# EAGLE design ram (EAGLE 5.12)

## Sheet 1 of 3
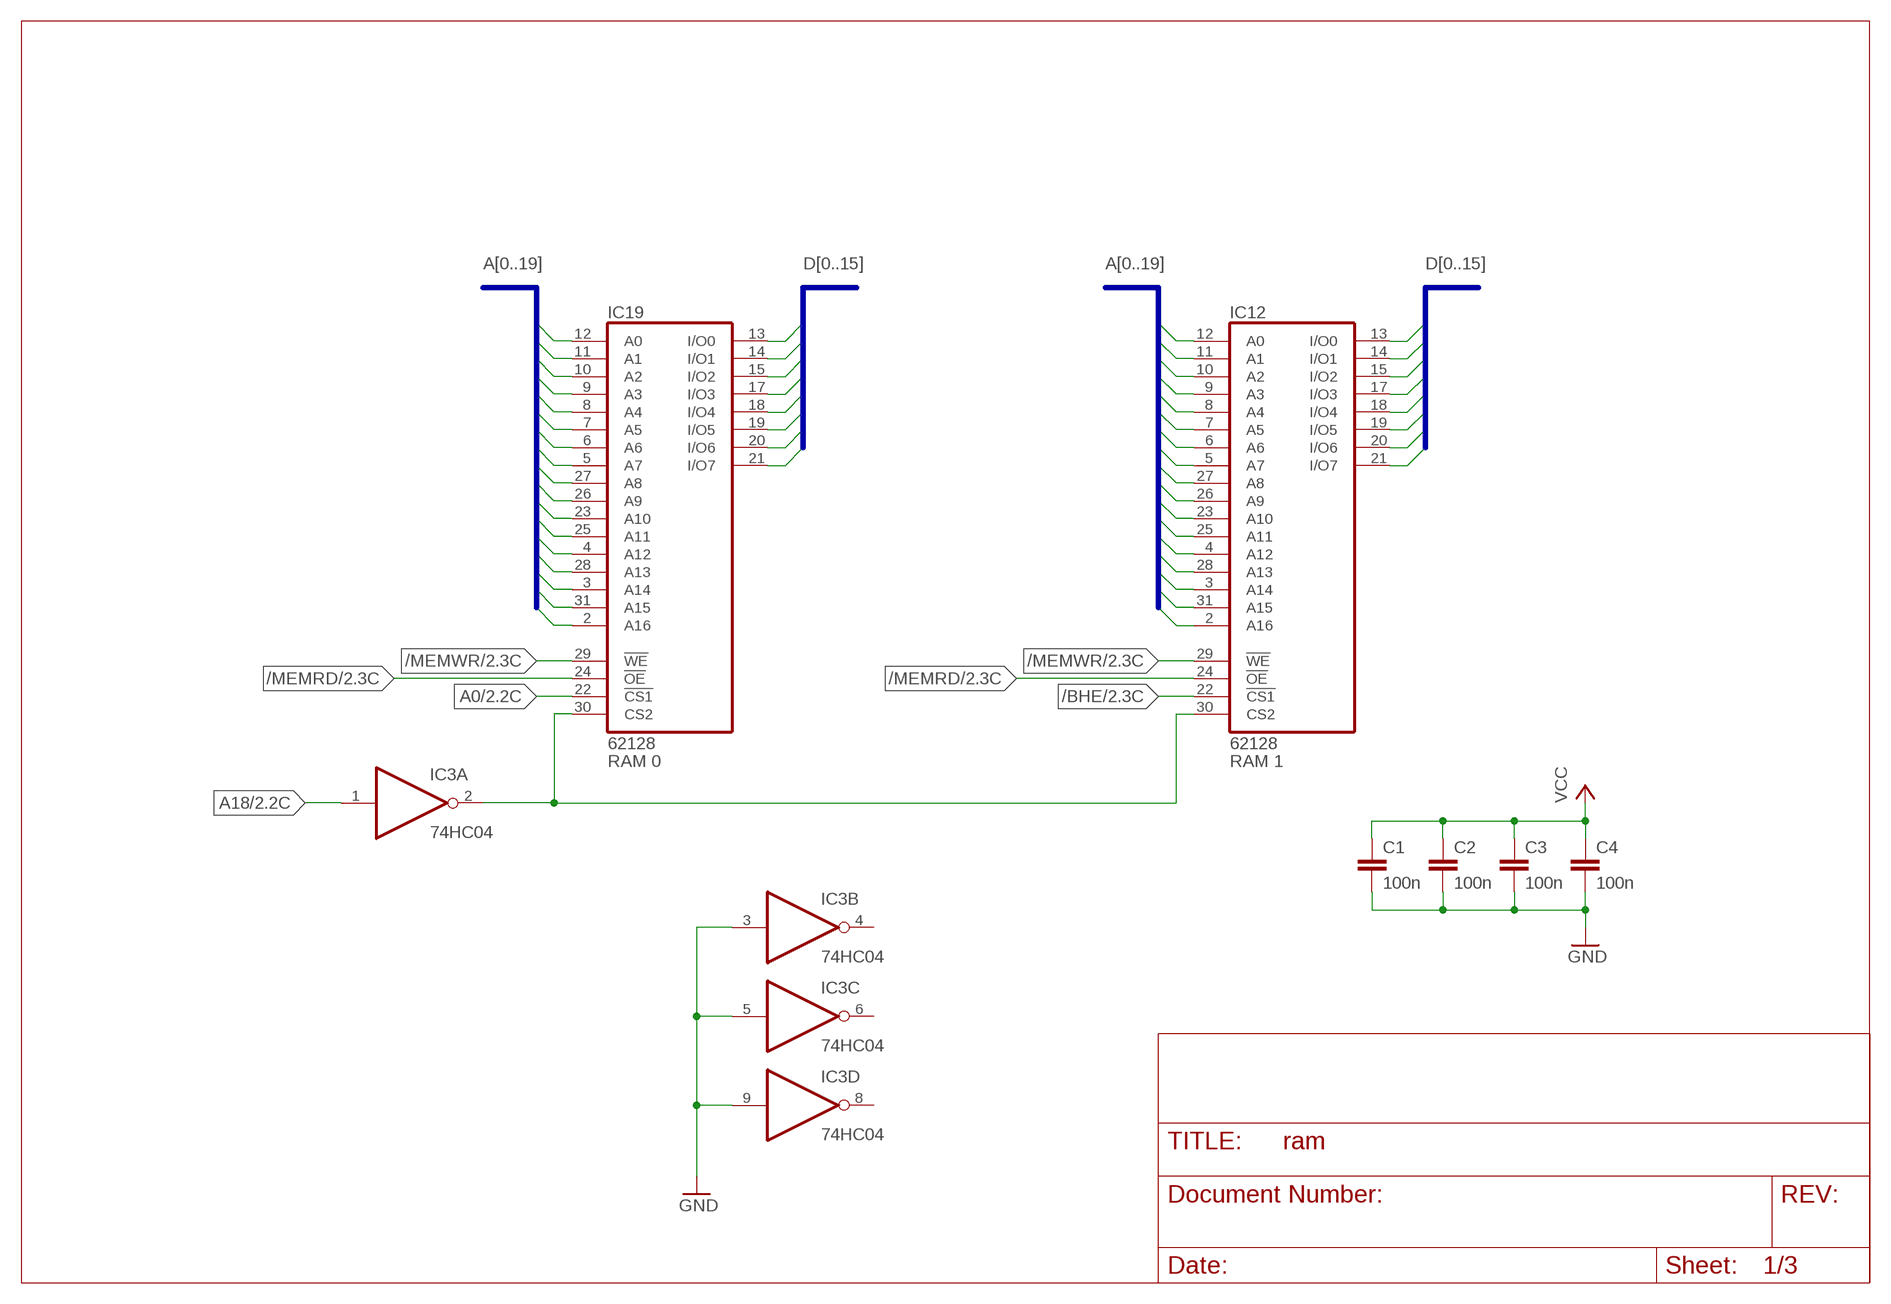
[diagram p0: schematic, sheet 1]

### Parts
C1  100n  C-EU050-024X044  [C050-024X044]
C2  100n  C-EU050-024X044  [C050-024X044]
C3  100n  C-EU050-024X044  [C050-024X044]
C4  100n  C-EU050-024X044  [C050-024X044]
IC3  74HC04  7404D  [SO14]
IC12  62128  LP621024CM  [SOP32L]
IC19  62128  LP621024CM  [SOP32L]

### Nets
/BHE: IC12.22(!CS1) ; also sheet 2,3
/MEMRD: IC12.24(!OE) IC19.24(!OE) ; also sheet 2,3
/MEMWR: IC12.29(!WE) IC19.29(!WE) ; also sheet 2,3
A0: IC19.22(!CS1) ; also sheet 2,3
A1: IC12.12(A0) IC19.12(A0) ; also sheet 2,3
A2: IC12.11(A1) IC19.11(A1) ; also sheet 2,3
A3: IC12.10(A2) IC19.10(A2) ; also sheet 2,3
A4: IC12.9(A3) IC19.9(A3) ; also sheet 2,3
A5: IC12.8(A4) IC19.8(A4) ; also sheet 2,3
A6: IC12.7(A5) IC19.7(A5) ; also sheet 2,3
A7: IC12.6(A6) IC19.6(A6) ; also sheet 2,3
A8: IC12.5(A7) IC19.5(A7) ; also sheet 2,3
A9: IC12.27(A8) IC19.27(A8) ; also sheet 2,3
A10: IC12.26(A9) IC19.26(A9) ; also sheet 2,3
A11: IC12.23(A10) IC19.23(A10) ; also sheet 2,3
A12: IC12.25(A11) IC19.25(A11) ; also sheet 2,3
A13: IC12.4(A12) IC19.4(A12) ; also sheet 2,3
A14: IC12.28(A13) IC19.28(A13) ; also sheet 2,3
A15: IC12.3(A14) IC19.3(A14) ; also sheet 2,3
A16: IC12.31(A15) IC19.31(A15) ; also sheet 2,3
A17: IC12.2(A16) IC19.2(A16) ; also sheet 2,3
A18: IC3.1(A:I) ; also sheet 2,3
CS_BANK0: IC3.2(A:O) IC12.30(CS2) IC19.30(CS2)
D0: IC19.13(I/O0) ; also sheet 2,3
D1: IC19.14(I/O1) ; also sheet 2,3
D2: IC19.15(I/O2) ; also sheet 2,3
D3: IC19.17(I/O3) ; also sheet 2,3
D4: IC19.18(I/O4) ; also sheet 2,3
D5: IC19.19(I/O5) ; also sheet 2,3
D6: IC19.20(I/O6) ; also sheet 2,3
D7: IC19.21(I/O7) ; also sheet 2,3
D8: IC12.13(I/O0) ; also sheet 2,3
D9: IC12.14(I/O1) ; also sheet 2,3
D10: IC12.15(I/O2) ; also sheet 2,3
D11: IC12.17(I/O3) ; also sheet 2,3
D12: IC12.18(I/O4) ; also sheet 2,3
D13: IC12.19(I/O5) ; also sheet 2,3
D14: IC12.20(I/O6) ; also sheet 2,3
D15: IC12.21(I/O7) ; also sheet 2,3
GND: C1.2 C2.2 C3.2 C4.2 IC3.3(B:I) IC3.5(C:I) IC3.9(D:I) ; also sheet 2,3
VCC: C1.1 C2.1 C3.1 C4.1 ; also sheet 2,3
Unconnected: IC3.4(B:O) IC3.6(C:O) IC3.8(D:O) IC12.1(NC) IC19.1(NC)

### Buses
D[0..15]
A[0..19]

### Notes on the sheet
- RAM 0 | RAM 1

## Sheet 2 of 3
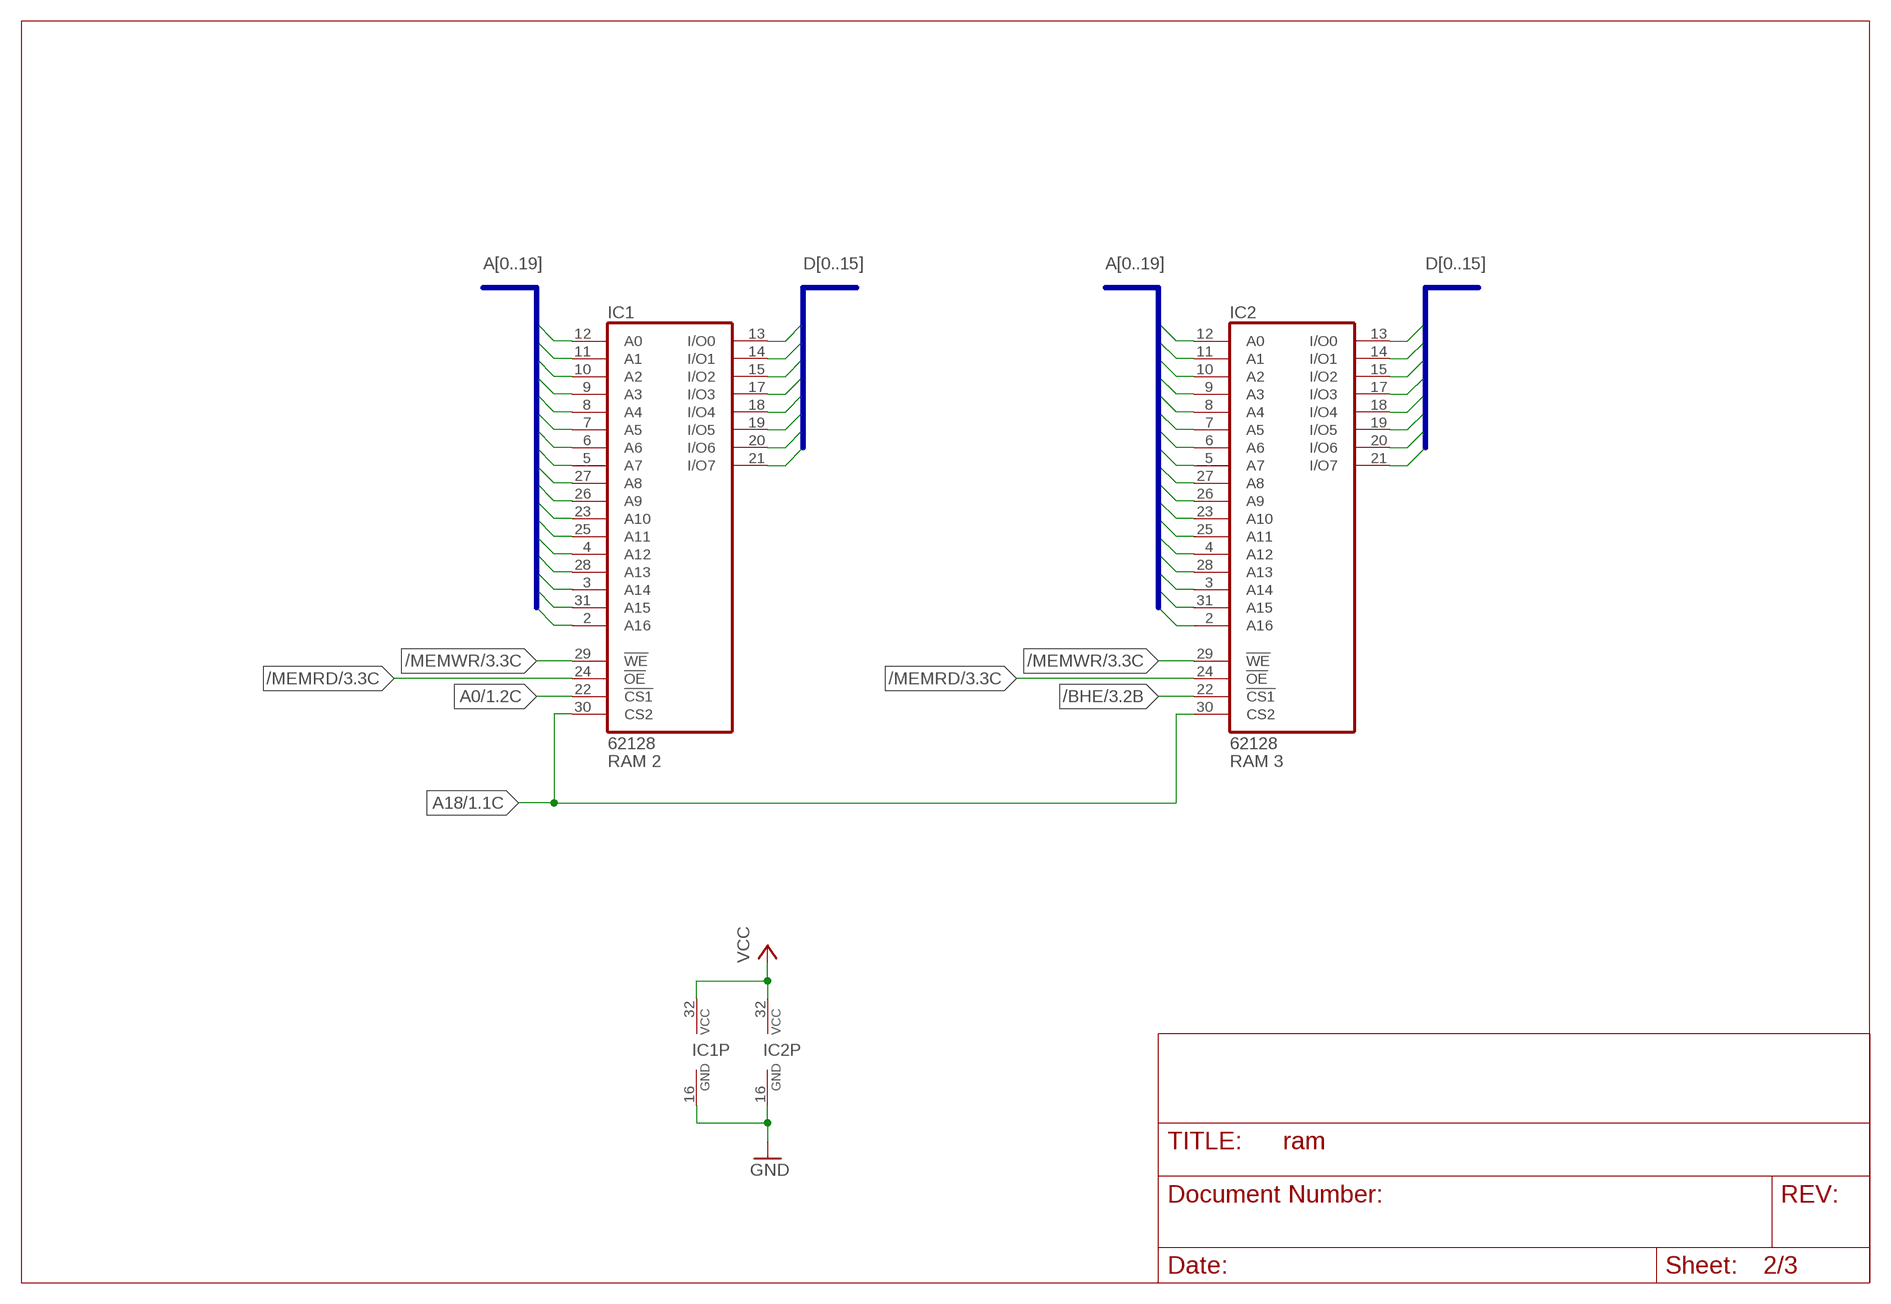
[diagram p1: schematic, sheet 2]

### Parts
IC1  62128  LP621024CM  [SOP32L]
IC2  62128  LP621024CM  [SOP32L]

### Nets
/BHE: IC2.22(!CS1) ; also sheet 1,3
/MEMRD: IC1.24(!OE) IC2.24(!OE) ; also sheet 1,3
/MEMWR: IC1.29(!WE) IC2.29(!WE) ; also sheet 1,3
A0: IC1.22(!CS1) ; also sheet 1,3
A1: IC1.12(A0) IC2.12(A0) ; also sheet 1,3
A2: IC1.11(A1) IC2.11(A1) ; also sheet 1,3
A3: IC1.10(A2) IC2.10(A2) ; also sheet 1,3
A4: IC1.9(A3) IC2.9(A3) ; also sheet 1,3
A5: IC1.8(A4) IC2.8(A4) ; also sheet 1,3
A6: IC1.7(A5) IC2.7(A5) ; also sheet 1,3
A7: IC1.6(A6) IC2.6(A6) ; also sheet 1,3
A8: IC1.5(A7) IC2.5(A7) ; also sheet 1,3
A9: IC1.27(A8) IC2.27(A8) ; also sheet 1,3
A10: IC1.26(A9) IC2.26(A9) ; also sheet 1,3
A11: IC1.23(A10) IC2.23(A10) ; also sheet 1,3
A12: IC1.25(A11) IC2.25(A11) ; also sheet 1,3
A13: IC1.4(A12) IC2.4(A12) ; also sheet 1,3
A14: IC1.28(A13) IC2.28(A13) ; also sheet 1,3
A15: IC1.3(A14) IC2.3(A14) ; also sheet 1,3
A16: IC1.31(A15) IC2.31(A15) ; also sheet 1,3
A17: IC1.2(A16) IC2.2(A16) ; also sheet 1,3
A18: IC1.30(CS2) IC2.30(CS2) ; also sheet 1,3
D0: IC1.13(I/O0) ; also sheet 1,3
D1: IC1.14(I/O1) ; also sheet 1,3
D2: IC1.15(I/O2) ; also sheet 1,3
D3: IC1.17(I/O3) ; also sheet 1,3
D4: IC1.18(I/O4) ; also sheet 1,3
D5: IC1.19(I/O5) ; also sheet 1,3
D6: IC1.20(I/O6) ; also sheet 1,3
D7: IC1.21(I/O7) ; also sheet 1,3
D8: IC2.13(I/O0) ; also sheet 1,3
D9: IC2.14(I/O1) ; also sheet 1,3
D10: IC2.15(I/O2) ; also sheet 1,3
D11: IC2.17(I/O3) ; also sheet 1,3
D12: IC2.18(I/O4) ; also sheet 1,3
D13: IC2.19(I/O5) ; also sheet 1,3
D14: IC2.20(I/O6) ; also sheet 1,3
D15: IC2.21(I/O7) ; also sheet 1,3
GND: IC1.16(GND) IC2.16(GND) ; also sheet 1,3
VCC: IC1.32(VCC) IC2.32(VCC) ; also sheet 1,3
Unconnected: IC1.1(NC) IC2.1(NC)

### Buses
D[0..15]
A[0..19]

### Notes on the sheet
- RAM 2 | RAM 3

## Sheet 3 of 3
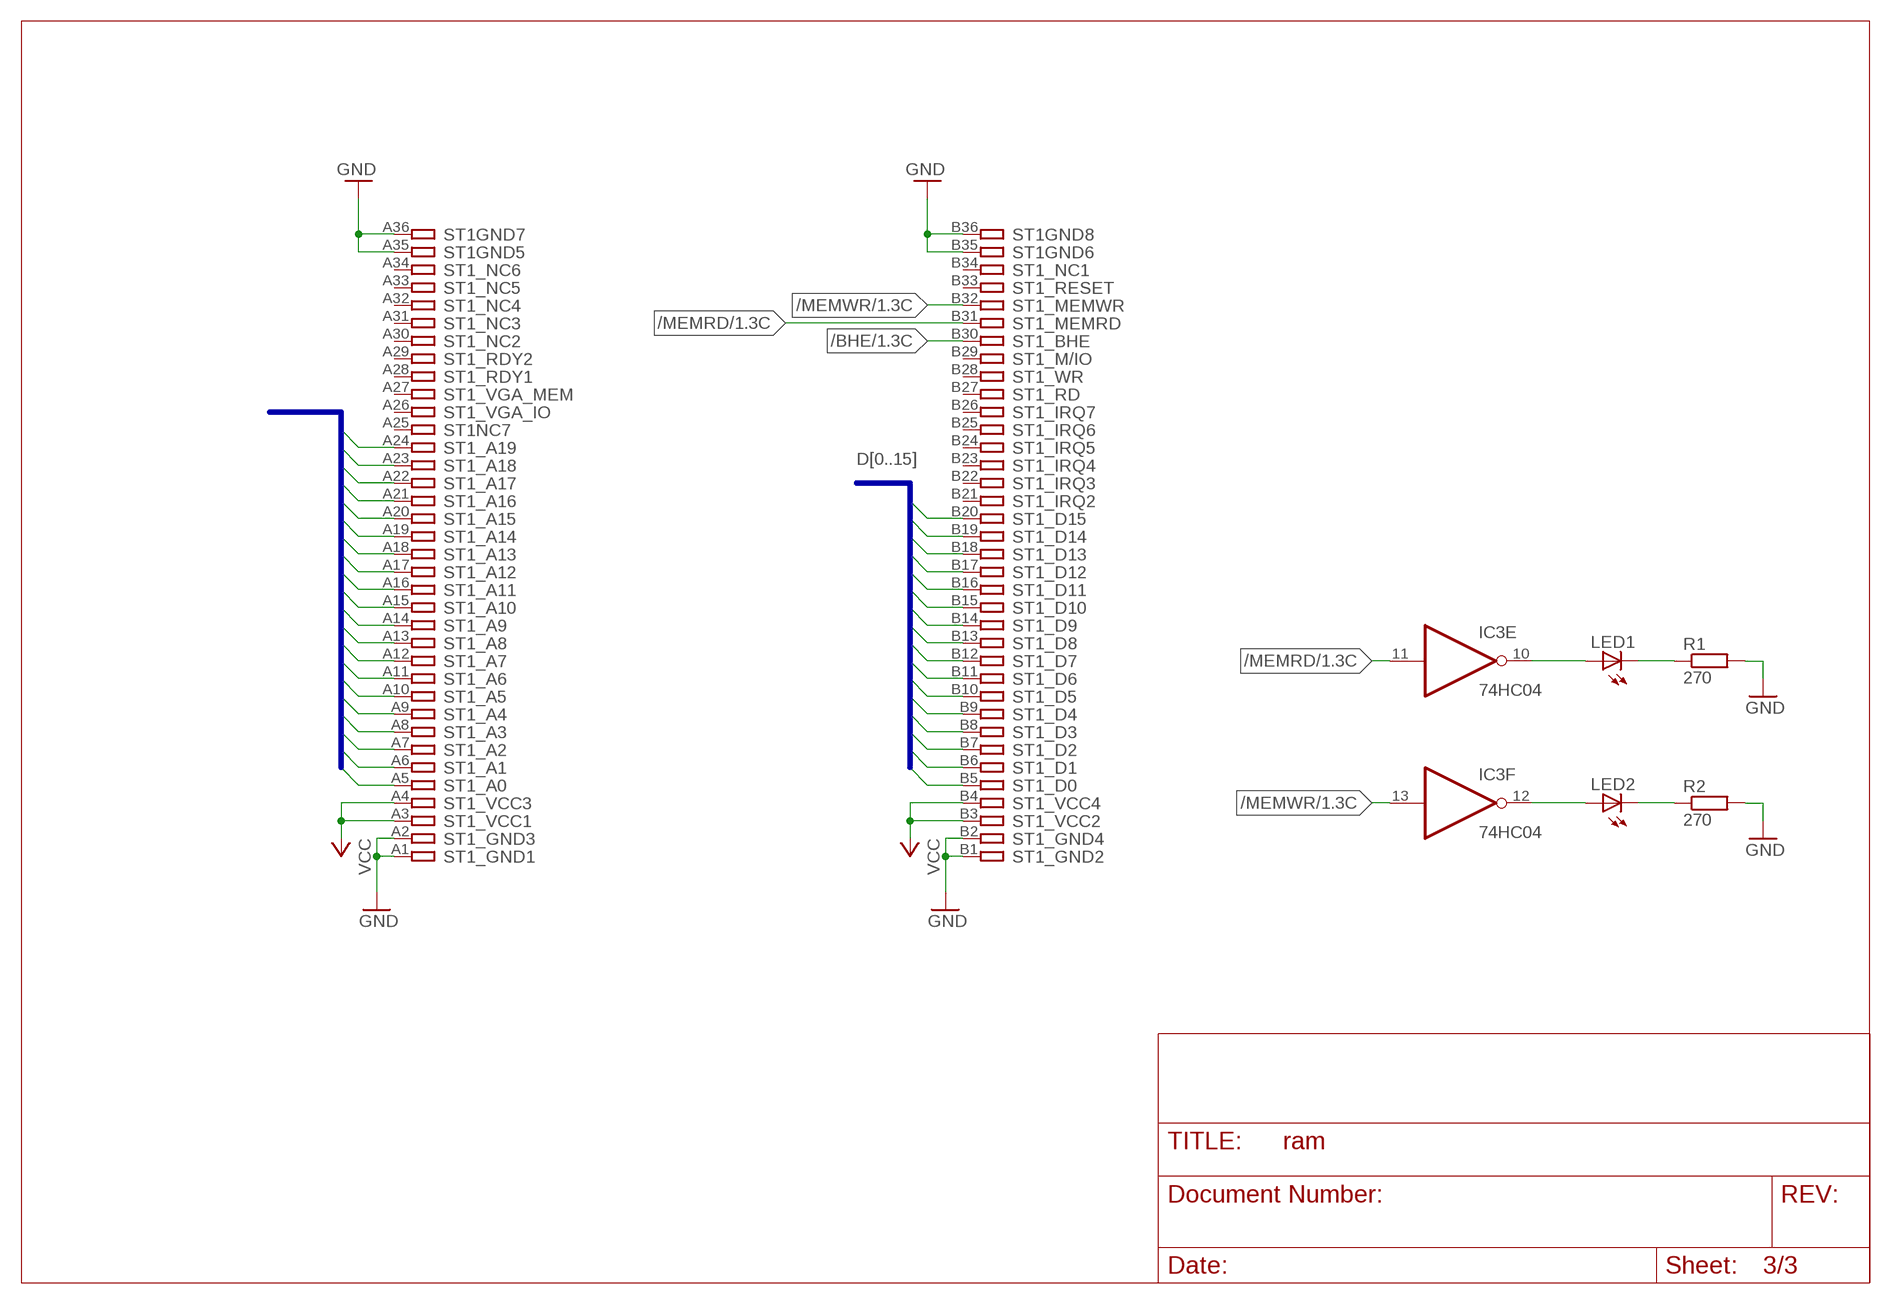
[diagram p2: schematic, sheet 3]

### Parts
LED1  LED5MM  [LED5MM]
LED2  LED5MM  [LED5MM]
R1  270  R-EU_0207/7  [0207/7]
R2  270  R-EU_0207/7  [0207/7]
ST1  MINI8086_EDGE  [MINI8086_CON]

### Nets
/BHE: ST1.B30 ; also sheet 1,2
/MEMRD: IC3.11(E:I) ST1.B31 ; also sheet 1,2
/MEMWR: IC3.13(F:I) ST1.B32 ; also sheet 1,2
A0: ST1.A5 ; also sheet 1,2
A1: ST1.A6 ; also sheet 1,2
A2: ST1.A7 ; also sheet 1,2
A3: ST1.A8 ; also sheet 1,2
A4: ST1.A9 ; also sheet 1,2
A5: ST1.A10 ; also sheet 1,2
A6: ST1.A11 ; also sheet 1,2
A7: ST1.A12 ; also sheet 1,2
A8: ST1.A13 ; also sheet 1,2
A9: ST1.A14 ; also sheet 1,2
A10: ST1.A15 ; also sheet 1,2
A11: ST1.A16 ; also sheet 1,2
A12: ST1.A17 ; also sheet 1,2
A13: ST1.A18 ; also sheet 1,2
A14: ST1.A19 ; also sheet 1,2
A15: ST1.A20 ; also sheet 1,2
A16: ST1.A21 ; also sheet 1,2
A17: ST1.A22 ; also sheet 1,2
A18: ST1.A23 ; also sheet 1,2
A19: ST1.A24
D0: ST1.B5 ; also sheet 1,2
D1: ST1.B6 ; also sheet 1,2
D2: ST1.B7 ; also sheet 1,2
D3: ST1.B8 ; also sheet 1,2
D4: ST1.B9 ; also sheet 1,2
D5: ST1.B10 ; also sheet 1,2
D6: ST1.B11 ; also sheet 1,2
D7: ST1.B12 ; also sheet 1,2
D8: ST1.B13 ; also sheet 1,2
D9: ST1.B14 ; also sheet 1,2
D10: ST1.B15 ; also sheet 1,2
D11: ST1.B16 ; also sheet 1,2
D12: ST1.B17 ; also sheet 1,2
D13: ST1.B18 ; also sheet 1,2
D14: ST1.B19 ; also sheet 1,2
D15: ST1.B20 ; also sheet 1,2
GND: R1.2 R2.2 ST1.A1 ST1.A2 ST1.A35 ST1.A36 ST1.B1 ST1.B2 ST1.B35 ST1.B36 ; also sheet 1,2
N$1: IC3.10(E:O) LED1.A
N$2: IC3.12(F:O) LED2.A
N$3: LED1.K(C) R1.1
N$4: LED2.K(C) R2.1
VCC: ST1.A3 ST1.A4 ST1.B3 ST1.B4 ; also sheet 1,2
Unconnected: ST1.A25 ST1.A26 ST1.A27 ST1.A28 ST1.A29 ST1.A30 ST1.A31 ST1.A32 ST1.A33 ST1.A34 ST1.B21 ST1.B22 ST1.B23 ST1.B24 ST1.B25 ST1.B26 ST1.B27 ST1.B28 ST1.B29 ST1.B33 ST1.B34

### Buses
D[0..15]
A[0..19]

## Power pins joined to a net without a drawn wire
GND: IC3.7(P:GND) IC12.16(GND) IC19.16(GND)
VCC: IC3.14(P:VCC) IC12.32(VCC) IC19.32(VCC)

## Library data of the parts
C1-C4 = rcl:C-EU: CAPACITOR, European symbol
IC1 IC2 IC12 IC19 = memory:LP621024CM: MEMORY
IC3 = 74xx-us:74*04: Hex INVERTER
LED1 LED2 = led:LED: LED OSRAM: - CHIPLED LG R971, LG N971, LY N971, LG Q971, LY Q971, LO R971, LY R971 LH N974, LH R974 LS Q976, LO Q976, LY Q976 LO Q996 - Hyper CHIPLED LW Q18S LB Q993, LB Q99A, LB R99A - SideLED LS A670, LO A670, LY A670, LG A670, LP A670 LB A673, LV A673, LT A673, LW A673 LH A674 LY A675 LS A676, LA A676, LO A676, LY A676, LW A676 LS A679, LY A679, LG A679 - Hyper Micro SIDELED® LS Y876, LA Y876, LO Y876, LY Y876 LT Y87S - SmartLED LW L88C, LW L88S LB L89C, LB L89S, LG L890 LS L89K, LO L89K, LY L89K LS L896, LA L896, LO L896, LY L896 - TOPLED LS T670, LO T670, LY T670, LG T670, LP T670 LSG T670, LSP T670, LSY T670, LOP T670, LYG T670 LG T671, LOG T671, LSG T671 LB T673, LV T673, LT T673, LW T673 LH T674 LS T676, LA T676, LO T676, LY T676, LB T676, LH T676, LSB T676, LW T676 LB T67C, LV T67C, LT T67C, LS T67K, LO T67K, LY T67K, LW E67C LS E67B, LA E67B, LO E67B, LY E67B, LB E67C, LV E67C, LT E67C LW T67C LS T679, LY T679, LG T679 LS T770, LO T770, LY T770, LG T770, LP T770 LB T773, LV T773, LT T773, LW T773 LH T774 LS E675, LA E675, LY E675, LS T675 LS T776, LA T776, LO T776, LY T776, LB T776 LHGB T686 LT T68C, LB T68C - Hyper Mini TOPLED® LB M676 - Mini TOPLED Santana® LG M470 LS M47K, LO M47K, LY M47K Source: http://www.osram.convergy.de LUXEON: - LUMILED® LXK2-PW12-R00, LXK2-PW12-S00, LXK2-PW14-U00, LXK2-PW14-V00 LXK2-PM12-R00, LXK2-PM12-S00, LXK2-PM14-U00 LXK2-PE12-Q00, LXK2-PE12-R00, LXK2-PE12-S00, LXK2-PE14-T00, LXK2-PE14-U00 LXK2-PB12-K00, LXK2-PB12-L00, LXK2-PB12-M00, LXK2-PB14-N00, LXK2-PB14-P00, LXK2-PB14-Q00 LXK2-PR12-L00, LXK2-PR12-M00, LXK2-PR14-Q00, LXK2-PR14-R00 LXK2-PD12-Q00, LXK2-PD12-R00, LXK2-PD12-S00 LXK2-PH12-R00, LXK2-PH12-S00 LXK2-PL12-P00, LXK2-PL12-Q00, LXK2-PL12-R00 Source: www.luxeon.com KINGBRIGHT: KA-3528ASYC Source: www.kingbright.com
R1 R2 = rcl:R-EU_: RESISTOR, European symbol
ST1 = con-mini8086:MINI8086_EDGE: Mini8086 slot connector

## Board
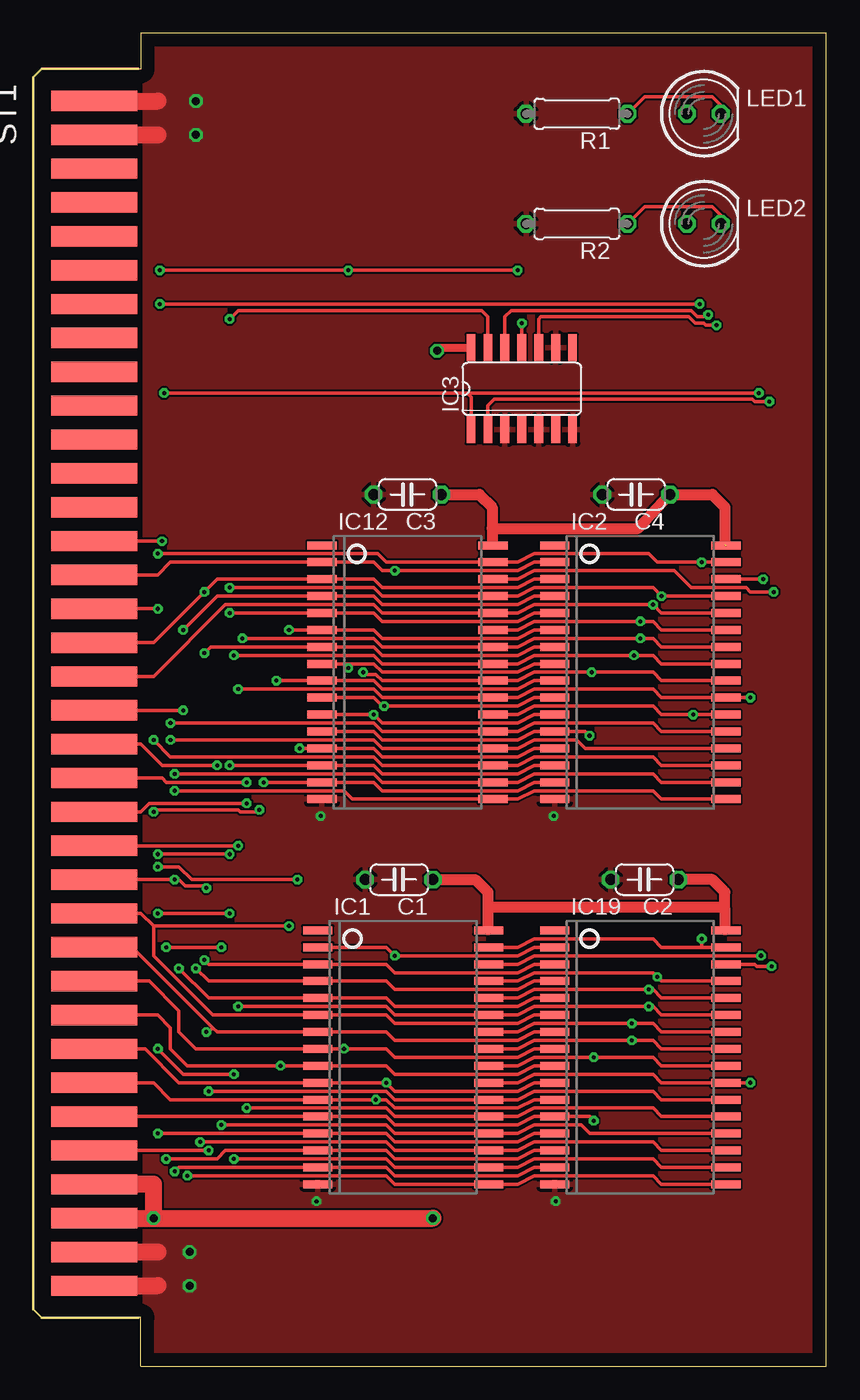
[diagram p3: board, top side]
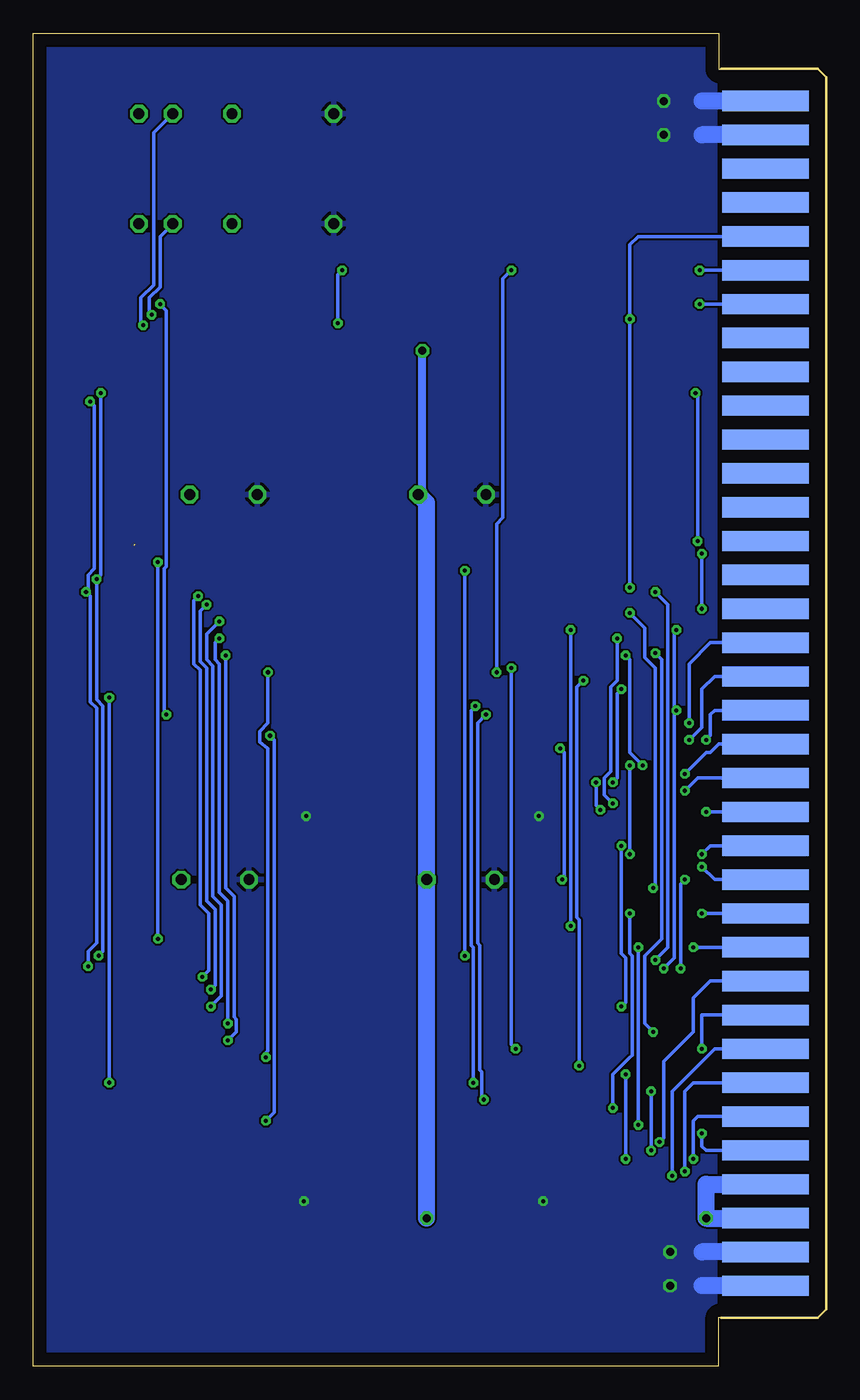
[diagram p4: board, bottom side, seen from below]

Size 59.48 x 100.01 mm. Coordinates in mm from the lower left corner, seen from the top.
Outline: 8.06,100 59.48,100 59.48,0 8.06,0 8.06,3.65 7.91,3.65
Outline: 8.06,100.01 8.06,97.31 7.91,97.31
Copper layers (1*16): Top 0.035mm / dielectric 1.5mm / Bottom 0.035mm
Design rules "default *": minimum track width 10mil, minimum drill 12mil, track to track 6mil, track to pad 6mil, pad to pad 6mil, via to via 6mil, smd to smd 6mil, copper to edge 40mil, drill to drill 8mil, minimum pad ring 10mil, minimum via ring 8mil, stop-mask expansion 4mil, vias tented up to drill 0mil, thermal gap 10mil

### Footprints (pad centres in the part's own frame; a part is rotated, then mirrored left to right if it is on the bottom)
C050-024X044 = drill 0.813 octagon: 1 -2.54,0; 2 2.54,0
SOP32L = smd 0.6 x 2.2: 1 -9.525,-6.416; 2 -8.255,-6.416; 3 -6.985,-6.416; 4 -5.715,-6.416; 5 -4.445,-6.416; 6 -3.175,-6.416; 7 -1.905,-6.416; 8 -0.635,-6.416; 9 0.635,-6.416; 10 1.905,-6.416; 11 3.175,-6.416; 12 4.445,-6.416; 13 5.715,-6.416; 14 6.985,-6.416; 15 8.255,-6.416; 16 9.525,-6.416; 17 9.525,6.416; 18 8.255,6.416; 19 6.985,6.416; 20 5.715,6.416; 21 4.445,6.416; 22 3.175,6.416; 23 1.905,6.416; 24 0.635,6.416; 25 -0.635,6.416; 26 -1.905,6.416; 27 -3.175,6.416; 28 -4.445,6.416; 29 -5.715,6.416; 30 -6.985,6.416; 31 -8.255,6.416; 32 -9.525,6.416
SO14 = smd 0.66 x 2.032: 1 -3.81,-3.073; 2 -2.54,-3.073; 3 -1.27,-3.073; 4 0,-3.073; 5 1.27,-3.073; 6 2.54,-3.073; 7 3.81,-3.073; 8 3.81,3.073; 9 2.54,3.073; 10 1.27,3.073; 11 0,3.073; 12 -1.27,3.073; 13 -2.54,3.073; 14 -3.81,3.073
LED5MM = drill 0.813 octagon: A -1.27,0; K 1.27,0
0207/7 = drill 0.813 octagon: 1 -3.81,0; 2 3.81,0
MINI8086_CON = smd 1.524 x 6.477: A1 -5.08,5.08; A2 -7.62,5.08; A3 -10.16,5.08; A4 -12.7,5.08; A5 -15.24,5.08; A6 -17.78,5.08; A7 -20.32,5.08; A8 -22.86,5.08; A9 -25.4,5.08; A10 -27.94,5.08; A11 -30.48,5.08; A12 -33.02,5.08; A13 -35.56,5.08; A14 -38.1,5.08; A15 -40.64,5.08; A16 -43.18,5.08; A17 -45.72,5.08; A18 -48.26,5.08; A19 -50.8,5.08; A20 -53.34,5.08; A21 -55.88,5.08; A22 -58.42,5.08; A23 -60.96,5.08; A24 -63.5,5.08; A25 -66.04,5.08; A26 -68.58,5.08; A27 -71.12,5.08; A28 -73.66,5.08; A29 -76.2,5.08; A30 -78.74,5.08; A31 -81.28,5.08; A32 -83.82,5.08; A33 -86.36,5.08; A34 -88.9,5.08; A35 -91.44,5.08; A36 -93.98,5.08 | smd 1.524 x 6.477 bottom: B1 -5.08,5.08; B2 -7.62,5.08; B3 -10.16,5.08; B4 -12.7,5.08; B5 -15.24,5.08; B6 -17.78,5.08; B7 -20.32,5.08; B8 -22.86,5.08; B9 -25.4,5.08; B10 -27.94,5.08; B11 -30.48,5.08; B12 -33.02,5.08; B13 -35.56,5.08; B14 -38.1,5.08; B15 -40.64,5.08; B16 -43.18,5.08; B17 -45.72,5.08; B18 -48.26,5.08; B19 -50.8,5.08; B20 -53.34,5.08; B21 -55.88,5.08; B22 -58.42,5.08; B23 -60.96,5.08; B24 -63.5,5.08; B25 -66.04,5.08; B26 -68.58,5.08; B27 -71.12,5.08; B28 -73.66,5.08; B29 -76.2,5.08; B30 -78.74,5.08; B31 -81.28,5.08; B32 -83.82,5.08; B33 -86.36,5.08; B34 -88.9,5.08; B35 -91.44,5.08; B36 -93.98,5.08

### Placement (x,y rotation side)
C1  27.43,36.51 180 top
C2  45.85,36.51 180 top
C3  28.07,65.41 180 top
C4  45.21,65.41 180 top
IC1  27.75,23.18 270 top
IC2  45.53,52.07 270 top
IC3  36.64,73.34 0 top
IC12  28.07,52.07 270 top
IC19  45.53,23.18 270 top
LED1  50.29,93.98 0 top
LED2  50.29,85.72 0 top
R1  40.77,93.98 180 top
R2  40.77,85.72 180 top
ST1  -0.51,0.95 270 top

### Tracks (layer width: path | path; a pad name or v marks a point on that pad's centre or on a via)
/BHE  (via drill 0.3)
  Top 0.254: IC12.22 36.32,48.9 37.59,49.53 46.48,49.53 47.12,48.9 v49.5,48.9 IC2.22 | v49.97,79.69 v9.49,79.69
  Bottom 0.254: v9.49,79.69 ST1.B30 | v49.97,79.69 49.5,79.22 49.5,60.01 49.66,59.85 49.66,49.05 v49.5,48.9
/MEMRD  (via drill 0.3)
  Top 0.254: IC2.24 47.12,51.44 46.48,52.07 v41.88,52.07 37.59,52.07 36.32,51.44 IC12.24 26.16,51.44 25.69,51.91 24.89,51.91 v24.73,52.07 | IC1.24 36.32,22.54 37.59,23.18 v42.04,23.18 46.48,23.18 47.12,22.54 IC19.24 | v9.49,82.23 v23.62,82.23 v36.32,82.23 | v36.64,78.26 IC3.11
  Bottom 0.254: v42.04,23.18 42.04,23.5 41.88,23.65 41.88,46.35 42.51,46.83 42.51,47.62 41.88,48.26 v41.88,52.07 | v24.73,52.07 24.73,63.18 24.26,63.66 24.26,81.6 v23.62,82.23 | v9.49,82.23 ST1.B31 | v36.64,78.26 36.64,81.92 v36.32,82.23
/MEMWR  (via drill 0.3)
  Top 0.254: IC2.29 v47.12,57.78 46.48,58.42 37.59,58.42 36.32,57.78 IC12.29 26.16,57.78 25.53,58.42 v14.73,58.42 | IC1.29 36.32,28.89 37.59,29.53 46.48,29.53 v46.8,29.21 47.12,28.89 IC19.29 | IC3.13 34.1,78.74 33.62,79.22 15.37,79.22 v14.73,78.58
  Bottom 0.254: v46.8,29.21 46.32,29.69 46.32,33.97 46.96,34.61 46.96,52.23 47.43,52.7 47.43,57.47 v47.12,57.78 | v14.73,58.42 v14.73,78.58 14.73,84.14 14.1,84.77 ST1.B32
A0  (via drill 0.3)
  Top 0.254: IC19.22 47.12,20 46.48,20.64 37.59,20.64 36.32,20 IC1.22 27.11,20 26.48,20.64 v13.14,20.64 | ST1.A5 v13.14,16.19
  Bottom 0.254: v13.14,16.19 v13.14,20.64
A1  (via drill 0.32)
  Top 0.254: IC12.12 25.53,47.62 26.16,46.99 36.32,46.99 37.59,47.62 IC2.12 41.4,47.62 v41.72,47.31 | v42.04,18.41 41.72,18.73 IC19.12 37.59,18.73 36.32,18.1 27.11,18.1 26.48,18.73 IC1.12 ST1.A6
  Bottom 0.254: v42.04,18.41 41.4,19.05 41.4,46.99 v41.72,47.31
A2  (via drill 0.3)
  Top 0.254: IC2.11 37.59,48.9 36.32,48.26 26.16,48.26 v25.53,48.9 IC12.11 | IC19.11 37.59,20 36.32,19.37 27.11,19.37 26.48,20 v25.69,20 IC1.11 10.29,20 9.02,21.27 ST1.A7
  Bottom 0.254: v25.53,48.9 26.16,48.26 26.16,31.75 26,31.59 26,22.23 25.84,22.07 25.84,20.16 v25.69,20
A3  (via drill 0.3)
  Top 0.254: IC12.10 25.53,50.16 26.16,49.53 v26.32,49.53 36.32,49.53 37.59,50.16 IC2.10 | IC19.10 37.59,21.27 36.32,20.64 27.11,20.64 v26.48,21.27 IC1.10 10.92,21.27 8.38,23.81 ST1.A8
  Bottom 0.254: v26.32,49.53 26.64,49.21 26.64,31.59 26.48,31.43 v26.48,21.27
A4  (via drill 0.3)
  Top 0.254: IC2.9 37.59,51.44 36.32,50.8 26.16,50.8 25.53,51.44 IC12.9 v18.23,51.44 | IC19.9 37.59,22.54 36.32,21.91 27.11,21.91 26.48,22.54 IC1.9 v18.54,22.54 11.56,22.54 10.29,23.81 10.29,25.4 9.33,26.35 ST1.A9
  Bottom 0.254: v18.23,51.44 18.7,50.96 18.7,33.66 18.54,33.5 v18.54,22.54
A5  (via drill 0.3)
  Top 0.254: IC2.8 37.59,52.7 36.32,52.07 26.16,52.07 25.53,52.7 IC12.8 23.3,52.7 v23.62,52.39 | IC19.8 37.59,23.81 36.32,23.18 27.11,23.18 26.48,23.81 v23.3,23.81 IC1.8 12.19,23.81 10.92,25.08 10.92,26.67 8.7,28.89 ST1.A10
  Bottom 0.254: v23.62,52.39 23.62,24.13 v23.3,23.81
A6  (via drill 0.3)
  Top 0.254: IC2.7 37.59,53.98 36.32,53.34 26.16,53.34 25.53,53.98 IC12.7 13.3,53.98 v12.83,53.5 | IC19.7 37.59,25.08 36.32,24.45 27.11,24.45 26.48,25.08 IC1.7 13.78,25.08 13.46,25.4 | ST1.A11 7.43,31.43 13.46,25.4 | v12.99,25.08 13.14,25.08 13.46,25.4
  Bottom 0.254: v12.83,53.5 | v12.83,53.5 12.35,53.02 12.35,32.07 13.62,30.8 13.62,25.72 v12.99,25.08
A7  (via drill 0.3)
  Top 0.254: IC2.6 37.59,55.24 36.32,54.61 26.16,54.61 25.53,55.24 IC12.6 v19.18,55.24 | IC19.6 37.59,26.35 36.32,25.72 27.11,25.72 26.48,26.35 IC1.6 13.46,26.35 9.02,30.8 9.02,33.02 | ST1.A12 8.06,33.97 9.02,33.02 | 9.02,33.02 v19.18,33.02
  Bottom 0.254: v19.18,33.02 v19.18,55.24
A8  (via drill 0.3)
  Top 0.254: IC2.5 37.59,56.52 36.32,55.88 26.16,55.88 25.53,56.52 IC12.5 v14.73,56.52 | IC19.5 37.59,27.62 36.32,26.99 27.11,26.99 26.48,27.62 IC1.5 13.14,27.62 v10.92,29.84 | ST1.A13 v10.61,36.51 10.92,36.51 11.4,36.04 12.83,36.04 v12.99,35.88
  Bottom 0.254: v10.92,29.84 10.92,36.2 v10.61,36.51 | v12.99,35.88 12.83,36.04 12.83,52.39 13.62,53.18 13.62,55.4 v14.73,56.52
A9  (via drill 0.3)
  Top 0.254: IC12.27 36.32,55.24 37.59,55.88 v45.53,55.88 46.48,55.88 47.12,55.24 IC2.27 | IC19.27 47.12,26.35 46.48,26.99 v46.16,26.99 37.59,26.99 36.32,26.35 IC1.27 27.11,26.35 26.48,26.99 v15.37,26.99 | v15.37,39.05 ST1.A14
  Bottom 0.254: v46.16,26.99 45.37,27.78 45.37,34.61 46.01,35.24 46.01,52.55 46.48,53.02 46.48,54.93 v45.53,55.88 | v15.37,26.99 15.05,27.3 15.05,30.64 15.37,30.96 v15.37,39.05
A10  (via drill 0.3)
  Top 0.254: IC2.26 47.12,53.98 46.48,54.61 v45.53,54.61 37.59,54.61 36.32,53.98 IC12.26 26.16,53.98 25.53,54.61 v15.68,54.61 | IC1.26 36.32,25.08 37.59,25.72 v44.89,25.72 46.48,25.72 47.12,25.08 IC19.26 | ST1.A15 8.06,41.59 8.7,42.23 v16,42.23
  Bottom 0.254: v44.89,25.72 44.89,34.92 45.53,35.56 45.53,52.7 45.85,53.02 45.85,54.29 v45.53,54.61 | v16,42.23 16.64,42.86 16.64,44.13 16.16,44.61 16.16,50.96 15.68,51.44 v15.68,54.61
A11  (via drill 0.3, 0.32)
  Top 0.254: IC1.23 36.32,21.27 37.59,21.91 46.48,21.91 47.12,21.27 IC19.23 v53.78,21.27 | v53.78,50.16 IC2.23 47.12,50.16 46.48,50.8 37.59,50.8 36.32,50.16 IC12.23 26.16,50.16 25.53,50.8 v15.37,50.8 | ST1.A16 9.65,44.13 9.97,43.81 v16,43.81
  Bottom 0.254: v53.78,50.16 v53.78,21.27 | v16,43.81 15.68,44.13 15.68,50.48 v15.37,50.8
A12  (via drill 0.3)
  Top 0.254: IC2.25 47.12,52.7 46.48,53.34 v45.05,53.34 37.59,53.34 36.32,52.7 IC12.25 26.16,52.7 25.53,53.34 v15.05,53.34 | IC1.25 36.32,23.81 37.59,24.45 v44.89,24.45 46.48,24.45 47.12,23.81 IC19.25 | ST1.A17 8.06,46.67 9.65,45.09 v13.78,45.09
  Bottom 0.254: v44.89,24.45 44.26,25.08 44.26,26.04 44.42,26.19 44.42,35.24 45.05,35.88 v45.05,53.34 | v13.78,45.09 14.73,46.04 14.73,53.02 v15.05,53.34
A13  (via drill 0.3)
  Top 0.254: IC2.4 37.59,57.78 36.32,57.15 26.16,57.15 25.53,57.78 IC12.4 13.78,57.78 v11.24,55.24 | IC19.4 37.59,28.89 36.32,28.26 27.11,28.26 26.48,28.89 IC1.4 13.14,28.89 v12.19,29.84 | v11.24,49.21 ST1.A18
  Bottom 0.254: v12.19,29.84 11.4,30.64 11.4,48.9 v11.24,49.21 11.4,49.37 11.4,55.09 v11.24,55.24
A14  (via drill 0.3)
  Top 0.254: IC2.28 47.12,56.52 v46.48,57.15 37.59,57.15 36.32,56.52 IC12.28 26.16,56.52 25.53,57.15 14.41,57.15 9.02,51.75 ST1.A19 | IC1.28 36.32,27.62 37.59,28.26 v46.16,28.26 46.48,28.26 47.12,27.62 IC19.28
  Bottom 0.254: v46.16,28.26 45.85,28.57 45.85,34.29 46.48,34.92 46.48,52.39 46.96,52.86 46.96,56.67 v46.48,57.15
A15  (via drill 0.3)
  Top 0.254: IC2.3 37.59,59.05 36.32,58.42 26.16,58.42 25.53,59.05 IC12.3 13.78,59.05 v12.83,58.1 9.02,54.29 ST1.A20 | IC19.3 37.59,30.16 36.32,29.53 27.11,29.53 26.48,30.16 IC1.3 13.14,30.16 v12.83,30.48
  Bottom 0.254: v12.83,30.48 11.88,31.43 11.88,57.15 v12.83,58.1
A16  (via drill 0.3, 0.32)
  Top 0.254: 50.13,31.43 IC19.31 | IC1.31 36.32,31.43 37.59,32.07 46.48,32.07 47.12,31.43 49.34,31.43 50.13,31.43 | IC2.31 v50.13,60.33 46.8,60.33 46.16,60.96 37.59,60.96 36.32,60.33 IC12.31 26.48,60.33 25.84,60.96 v9.33,60.96 | v50.13,32.07 50.13,31.43 | ST1.A21 v9.33,56.83
  Bottom 0.254: v50.13,60.33 v50.13,32.07 | v9.33,56.83 v9.33,60.96
A17  (via drill 0.3)
  Top 0.254: IC2.2 37.59,60.33 36.32,59.69 v27.11,59.69 26.16,59.69 25.53,60.33 IC12.2 10.29,60.33 9.33,59.37 ST1.A22 | IC19.2 37.59,31.43 36.32,30.8 v27.11,30.8 26.48,31.43 IC1.2
  Bottom 0.254: v27.11,30.8 v27.11,59.69
A18  (via drill 0.3, 0.32)
  Top 0.254: IC1.30 36.32,30.16 37.59,30.8 v54.58,30.8 | v54.74,59.05 IC2.30 | v9.65,61.91 ST1.A23 | 32.51,73.03 v9.81,73.03 | v54.42,73.03 32.51,73.03 | IC3.1 32.83,72.71 32.51,73.03
  Bottom 0.254: v54.58,30.8 | v54.58,30.8 54.26,31.11 54.26,49.53 54.74,50.01 v54.74,59.05 54.42,59.37 v54.42,73.03 | v9.65,61.91 9.65,72.87 v9.81,73.03
CS_BANK0  (via drill 0.3)
  Top 0.254: IC12.30 36.32,59.05 37.59,59.69 48.07,59.69 49.34,58.42 53.47,58.42 53.78,58.1 v55.53,58.1 | v55.37,30 55.05,30 54.26,30 54.1,30.16 IC19.30 | IC3.2 34.1,72.07 34.58,72.55 53.94,72.55 54.1,72.39 v55.21,72.39
  Bottom 0.254: v55.53,58.1 | v55.53,58.1 55.21,57.78 55.21,49.85 54.74,49.37 54.74,31.75 55.37,31.11 v55.37,30 | v55.21,72.39 54.9,72.07 54.9,59.85 55.37,59.37 55.37,58.26 v55.53,58.1
D0  (via drill 0.3)
  Top 0.254: IC19.13 37.59,17.46 36.32,16.83 27.11,16.83 26.48,17.46 IC1.13 v9.33,17.46
  Bottom 0.254: v9.33,17.46 9.33,16.51 9.02,16.19 ST1.B5
D1  (via drill 0.3)
  Top 0.254: IC19.14 37.59,16.19 36.32,15.56 27.11,15.56 26.48,16.19 IC1.14 14.41,16.19 13.78,15.56 v9.97,15.56
  Bottom 0.254: ST1.B6 9.65,18.73 9.97,18.41 v9.97,15.56
D2  (via drill 0.3)
  Top 0.254: IC19.15 37.59,14.92 36.32,14.29 27.11,14.29 26.48,14.92 IC1.15 10.92,14.92 v10.61,14.61
  Bottom 0.254: v10.61,14.61 10.61,20.64 9.97,21.27 ST1.B7
D3  (via drill 0.3)
  Top 0.254: IC19.17 47.12,13.65 46.48,14.29 37.59,14.29 36.32,13.65 IC1.17 27.11,13.65 26.48,14.29 v11.56,14.29
  Bottom 0.254: v11.56,14.29 11.56,20.64 8.38,23.81 ST1.B8
D4  (via drill 0.3)
  Top 0.254: IC19.18 47.12,14.92 46.48,15.56 37.59,15.56 36.32,14.92 IC1.18 27.11,14.92 26.48,15.56 v15.05,15.56 | v15.05,21.91 11.24,21.91 v9.33,23.81
  Bottom 0.254: ST1.B9 9.33,26.35 v9.33,23.81 | v15.05,21.91 v15.05,15.56
D5  (via drill 0.3)
  Top 0.254: IC19.19 47.12,16.19 46.48,16.83 37.59,16.83 36.32,16.19 IC1.19 27.11,16.19 26.48,16.83 v12.51,16.83
  Bottom 0.254: v12.51,16.83 12.19,17.14 12.19,22.86 9.97,25.08 9.97,27.62 8.7,28.89 ST1.B10
D6  (via drill 0.3)
  Top 0.254: IC19.20 41.72,17.46 41.09,18.1 37.59,18.1 36.32,17.46 IC1.20 27.11,17.46 26.48,18.1 v14.1,18.1 | v14.1,31.43 v9.97,31.43
  Bottom 0.254: v14.1,18.1 v14.1,31.43 | v9.97,31.43 ST1.B11
D7  (via drill 0.3)
  Top 0.254: IC19.21 47.12,18.73 46.48,19.37 37.59,19.37 36.32,18.73 IC1.21 27.11,18.73 26.48,19.37 v16,19.37 | v14.73,33.97 v9.33,33.97
  Bottom 0.254: v16,19.37 16,21.91 14.73,23.18 14.57,23.34 14.57,30.8 14.73,30.96 v14.73,33.97 | v9.33,33.97 ST1.B12
D8  (via drill 0.3)
  Top 0.254: IC2.13 37.59,46.35 36.32,45.72 26.16,45.72 25.53,46.35 IC12.13 v19.97,46.35 | v19.81,36.51 11.88,36.51 10.92,37.47 v9.33,37.47
  Bottom 0.254: v19.81,36.51 19.65,36.67 19.65,46.04 v19.97,46.35 | v9.33,37.47 8.38,36.51 ST1.B13
D9  (via drill 0.3)
  Top 0.254: IC2.14 37.59,45.09 36.32,44.45 26.16,44.45 25.53,45.09 IC12.14 v14.73,45.09 | v9.33,38.42 v14.73,38.42
  Bottom 0.254: v14.73,38.42 v14.73,45.09 | v9.33,38.42 8.7,39.05 ST1.B14
D10  (via drill 0.3)
  Top 0.254: IC2.15 37.59,43.81 36.32,43.18 26.16,43.18 25.53,43.81 IC12.15 v17.27,43.81 | v16.95,41.75 | v16.95,41.75 16.8,41.59 15.53,41.59 15.37,41.75 9.18,41.75 v9.02,41.59
  Bottom 0.254: ST1.B15 v9.02,41.59 | v17.27,43.81 17.27,42.07 v16.95,41.75
D11  (via drill 0.3)
  Top 0.254: IC2.17 47.12,42.55 46.48,43.18 37.59,43.18 36.32,42.55 IC12.17 23.94,42.55 23.3,43.18 v10.61,43.18
  Bottom 0.254: ST1.B16 9.65,44.13 v10.61,43.18
D12  (via drill 0.3)
  Top 0.254: IC2.18 47.12,43.81 46.48,44.45 37.59,44.45 36.32,43.81 IC12.18 26.16,43.81 25.53,44.45 v10.61,44.45
  Bottom 0.254: ST1.B17 8.06,46.67 8.7,46.04 9.02,46.04 v10.61,44.45
D13  (via drill 0.3)
  Top 0.254: IC2.19 47.12,45.09 46.48,45.72 37.59,45.72 36.32,45.09 IC12.19 26.16,45.09 25.53,45.72 10.29,45.72 v9.02,46.99
  Bottom 0.254: ST1.B18 8.38,49.21 8.7,48.9 8.7,47.31 v9.02,46.99
D14  (via drill 0.3)
  Top 0.254: IC2.20 41.4,46.35 40.77,46.99 37.59,46.99 36.32,46.35 IC12.20 26.16,46.35 25.53,46.99 v10.29,46.99
  Bottom 0.254: v10.29,46.99 9.33,47.94 9.33,50.8 8.38,51.75 ST1.B19
D15  (via drill 0.3)
  Top 0.254: IC2.21 47.12,47.62 46.48,48.26 37.59,48.26 36.32,47.62 IC12.21 26.16,47.62 25.53,48.26 v10.29,48.26
  Bottom 0.254: v10.29,48.26 10.29,52.7 8.7,54.29 ST1.B20
GND  (via drill 0.3, 0.6)
  Top 1.27: ST1.A36 9.33,94.93 | ST1.A35 9.33,92.39 | ST1.B2 9.33,8.57 | ST1.B1 9.33,6.03
  Bottom 1.27: ST1.A36 9.33,94.93 | ST1.A35 9.33,92.39 | ST1.B2 9.33,8.57 | ST1.B1 9.33,6.03
  other vias: 12.19,92.39 11.72,8.57 21.24,12.38 21.56,41.27 39.02,41.27 12.19,94.93 11.72,6.03 39.18,12.38
  pour Bottom: 8.38,100.33 60.13,100.33 60.13,0 8.38,0
  pour Top: 8.38,100.33 60.13,100.33 60.13,0 8.38,0
N$1  (via drill 0.3)
  Top 0.254: IC3.10 37.91,78.58 38.07,78.74 49.18,78.74 49.66,78.26 50.29,78.26 50.45,78.11 v51.24,78.11
  Bottom 0.254: v51.24,78.11 51.4,78.26 51.4,80.17 50.45,81.12 50.45,92.55 LED1.A
N$2  (via drill 0.3)
  Top 0.254: IC3.12 35.37,78.74 35.85,79.22 49.34,79.22 49.82,78.74 50.45,78.74 v50.61,78.9
  Bottom 0.254: v50.61,78.9 50.77,79.06 50.77,80.17 49.97,80.96 49.97,84.77 LED2.A
N$3
  Top 0.254: LED1.K 51.56,94.61 50.93,95.25 45.85,95.25 R1.1
N$4
  Top 0.254: LED2.K 51.56,86.36 50.93,87 45.85,87 R2.1
VCC  (via drill 0.6)  (1 unrouted)
  Top 0.254: 51.72,35.72 51.56,35.56 | 33.94,35.72 33.78,35.56 | 34.1,32.77 IC1.32
  Top 0.61: 33.94,35.72 34.1,35.56 | 51.88,35.56 51.72,35.72 | 51.88,32.77 IC19.32 | 34.42,61.66 IC12.32 | 51.72,34.45 51.88,34.29 | IC3.14 30.51,76.42 v30.29,76.2
  Top 0.813: C1.1 33.15,36.51 33.94,35.72 | 34.1,34.45 34.1,32.77 | C2.1 50.93,36.51 51.72,35.72 | 51.88,32.77 51.88,34.29 51.88,35.56 | C3.1 33.46,65.41 34.42,64.45 34.42,62.87 | 34.42,62.87 34.42,61.66 | 51.88,61.66 51.88,64.45 50.93,65.41 C4.1 45.37,62.87 34.42,62.87 | 34.1,35.56 34.1,34.45 | 34.1,34.45 51.72,34.45
  Top 1.27: ST1.A3 v9.02,11.11 | v9.02,11.11 9.02,13.65 ST1.A4 | v9.02,11.11 v29.97,11.11
  Bottom 0.61: v30.29,76.2 30.29,65.72 C3.1
  Bottom 1.27: ST1.A3 v9.02,11.11 9.02,13.65 ST1.A4 | C3.1 29.97,64.77 C1.1 v29.97,11.11

### Text on the board
tValues: READ | WRITE | 512 KB RAM board 1.0 | SP 2020